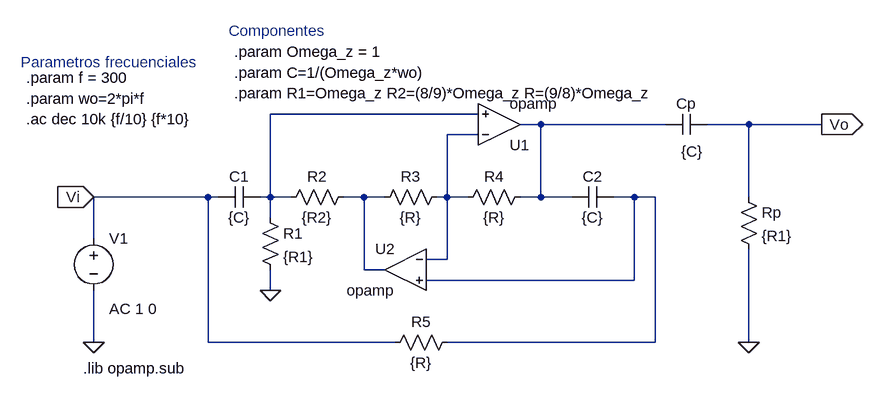
[diagram p0: schematic TS5_salidaPrimerOrden.asc]
TS5_salidaPrimerOrden.asc, the LTspice schematic file:
Version 4
SHEET 1 1628 680
WIRE 864 -16 544 -16
WIRE 960 0 928 0
WIRE 1152 0 960 0
WIRE 1280 0 1216 0
WIRE 1392 0 1280 0
WIRE 864 16 816 16
WIRE 448 112 272 112
WIRE 464 112 448 112
WIRE 544 112 544 -16
WIRE 544 112 528 112
WIRE 576 112 544 112
WIRE 688 112 656 112
WIRE 720 112 688 112
WIRE 816 112 816 16
WIRE 816 112 800 112
WIRE 848 112 816 112
WIRE 960 112 960 0
WIRE 960 112 928 112
WIRE 1008 112 960 112
WIRE 1104 112 1072 112
WIRE 1136 112 1104 112
WIRE 1280 112 1280 0
WIRE 544 144 544 112
WIRE 272 176 272 112
WIRE 816 208 816 112
WIRE 816 208 784 208
WIRE 688 224 688 112
WIRE 720 224 688 224
WIRE 1104 240 1104 112
WIRE 1104 240 784 240
WIRE 544 256 544 224
WIRE 272 336 272 256
WIRE 448 336 448 112
WIRE 736 336 448 336
WIRE 1136 336 1136 112
WIRE 1136 336 816 336
WIRE 1280 336 1280 192
FLAG 1392 0 Vo
IOPIN 1392 0 Out
FLAG 272 112 Vi
IOPIN 272 112 In
FLAG 544 256 0
FLAG 272 336 0
FLAG 1280 336 0
SYMBOL cap 528 96 R90
WINDOW 0 0 32 VBottom 2
WINDOW 3 32 32 VTop 2
SYMATTR InstName C1
SYMATTR Value {C}
SYMBOL OpAmps\\opamp 896 64 M180
SYMATTR InstName U1
SYMBOL OpAmps\\opamp 752 160 M0
SYMATTR InstName U2
SYMBOL res 672 96 R90
WINDOW 0 0 56 VBottom 2
WINDOW 3 32 56 VTop 2
SYMATTR InstName R2
SYMATTR Value {R2}
SYMBOL res 944 96 R90
WINDOW 0 0 56 VBottom 2
WINDOW 3 32 56 VTop 2
SYMATTR InstName R4
SYMATTR Value {R}
SYMBOL cap 1072 96 R90
WINDOW 0 0 32 VBottom 2
WINDOW 3 32 32 VTop 2
SYMATTR InstName C2
SYMATTR Value {C}
SYMBOL res 816 96 R90
WINDOW 0 0 56 VBottom 2
WINDOW 3 32 56 VTop 2
SYMATTR InstName R3
SYMATTR Value {R}
SYMBOL res 528 128 R0
SYMATTR InstName R1
SYMATTR Value {R1}
SYMBOL res 832 320 R90
WINDOW 0 0 56 VBottom 2
WINDOW 3 32 56 VTop 2
SYMATTR InstName R5
SYMATTR Value {R}
SYMBOL cap 1216 -16 R90
WINDOW 0 0 32 VBottom 2
WINDOW 3 42 23 VTop 2
SYMATTR InstName Cp
SYMATTR Value {C}
SYMBOL res 1264 96 R0
SYMATTR InstName Rp
SYMATTR Value {R1}
SYMBOL voltage 272 160 R0
WINDOW 123 24 124 Left 2
WINDOW 39 0 0 Left 0
SYMATTR Value2 AC 1 0
SYMATTR InstName V1
SYMATTR Value ""
TEXT 168 -40 Left 2 !.param wo=2*pi*f
TEXT 256 376 Left 2 !.lib opamp.sub
TEXT 168 -72 Left 2 !.param f = 300
TEXT 488 -80 Left 2 !.param C=1/(Omega_z*wo)
TEXT 168 -8 Left 2 !.ac dec 10k {f/10} {f*10}
TEXT 160 -96 Left 2 ;Parametros frecuenciales
TEXT 480 -144 Left 2 ;Componentes
TEXT 488 -112 Left 2 !.param Omega_z = 1
TEXT 488 -48 Left 2 !.param R1=Omega_z R2=(8/9)*Omega_z R=(9/8)*Omega_z

The netlist it stands for:
* TS5_salidaPrimerOrden.asc
C1 N001 Vi {C}
XU1 N003 N001 N002 opamp Aol=100K GBW=10Meg  ; pins invin noninvin out
XU2 N003 N005 N004 opamp Aol=100K GBW=10Meg  ; pins invin noninvin out
R2 N004 N001 {R2}
R4 N002 N003 {R}
C2 N005 N002 {C}
R3 N003 N004 {R}
R1 N001 0 {R1}
R5 N005 Vi {R}
Cp Vo N002 {C}
Rp Vo 0 {R1}
V1 Vi 0 AC 1 0
.param wo=2*pi*f
.lib opamp.sub
.param f = 300
.param C=1/(Omega_z*wo)
.ac dec 10k {f/10} {f*10}
* Parametros frecuenciales
* Componentes
.param Omega_z = 1
.param R1=Omega_z R2=(8/9)*Omega_z R=(9/8)*Omega_z
.backanno
.end